# EAGLE schematic pixelD (EAGLE 7.7.0)
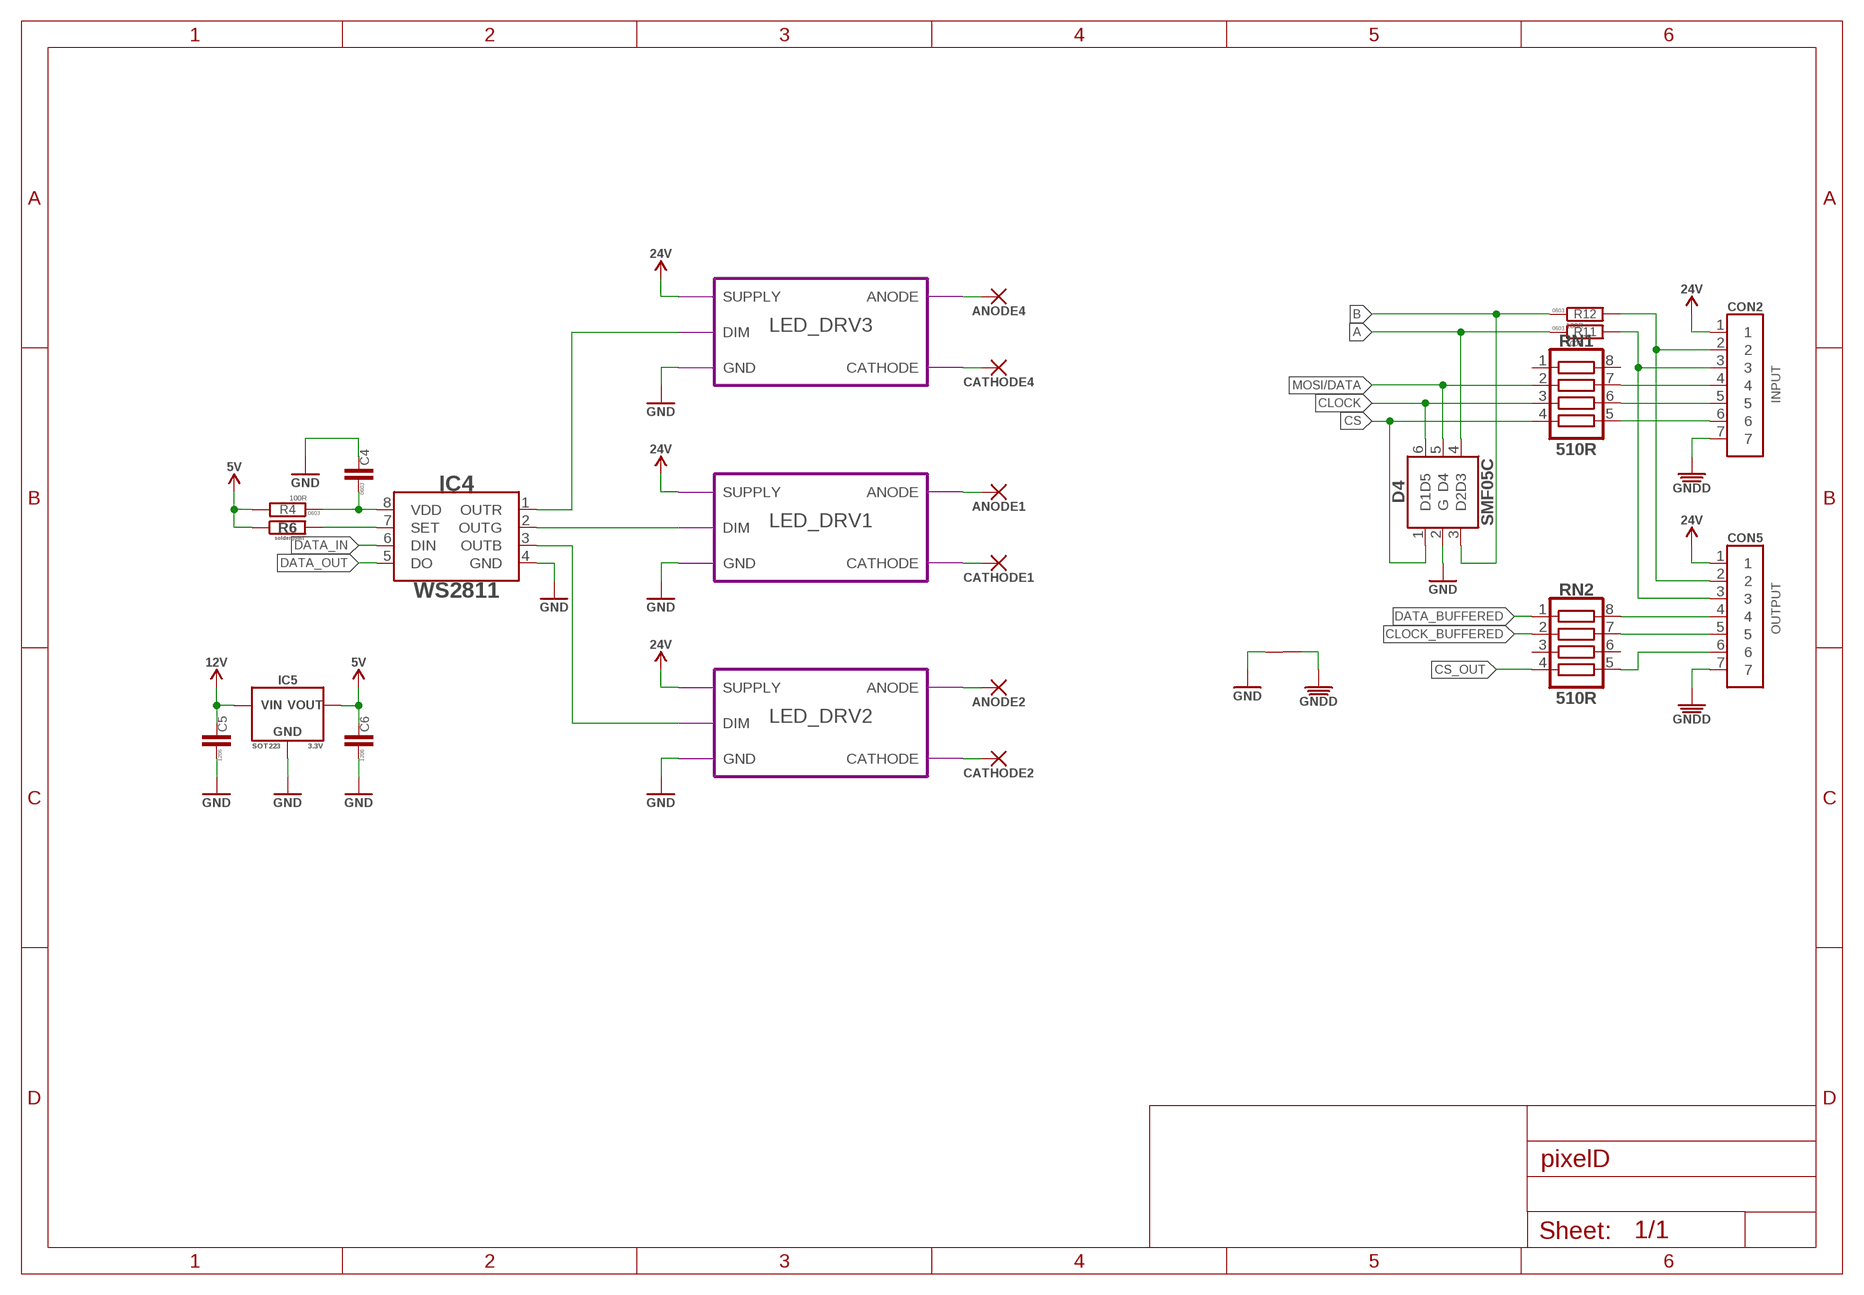
[diagram p0: schematic, sheet 1]

## Parts
ANODE1  WIREPADSMD5-2,5  [5-2,5]
ANODE2  WIREPADSMD5-2,5  [5-2,5]
ANODE4  WIREPADSMD5-2,5  [5-2,5]
C4  C-0603  [C0603]
C5  C-1206  [C1206]
C6  C-1206  [C1206]
CATHODE1  WIREPADSMD5-2,5  [5-2,5]
CATHODE2  WIREPADSMD5-2,5  [5-2,5]
CATHODE4  WIREPADSMD5-2,5  [5-2,5]
CON2  DS1066-07M-SIDE  [DS1066-08M_SIDE]
CON5  DS1066-07M-SIDE  [DS1066-08M_SIDE]
D4  SMF05C  [SC70_6L]
IC4  WS2811  [SOIC8]
IC5  LM1117-3.3-SOT223  [SOT223]
R4  100R  R-0603  [R0603]
R6  SOLDER_JOINT  [RES_0]
R11  100R  R-0603  [R0603]
R12  100R  R-0603  [R0603]
RN1  510R  RESISTOR_ARRAY  [CAT16-J4]
RN2  510R  RESISTOR_ARRAY  [CAT16-J4]
U$6  CONNECTION  [CONNECTION]

## Module instances
LED_DRV3 = PT4115$A
LED_DRV1 = PT4115$A
LED_DRV2 = PT4115$A

## Nets
A: D4.4(D3) R11.1
B: D4.3(D2) R12.1
CLOCK: D4.6(D5) RN1.3
CLOCK_BUFFERED: RN2.2
CS: D4.1(D1) RN1.4
CS_OUT: RN2.4
DATA_BUFFERED: RN2.1
DATA_IN: IC4.6(DIN)
DATA_OUT: IC4.5(DO)
GND: C4.2 C5.P$1 C6.P$1 D4.2(G) IC4.4(GND) IC5.1(GND) U$6.P$2 ; port LED_DRV3.GND LED_DRV1.GND LED_DRV2.GND
GNDD: CON2.7 CON5.7 U$6.P$1
MOSI/DATA: D4.5(D4) RN1.2
N$1: IC4.7(SET) R6.2
N$2: CATHODE1.1(P) ; port LED_DRV1.CATHODE
N$3: C4.1 IC4.8(VDD) R4.1
N$4: ANODE1.1(P) ; port LED_DRV1.ANODE
N$5: CATHODE2.1(P) ; port LED_DRV2.CATHODE
N$6: CON2.4 RN1.7
N$7: ANODE2.1(P) ; port LED_DRV2.ANODE
N$12: CON2.5 RN1.6
N$13: CON5.4 RN2.8
N$14: CON5.6 RN2.5
N$15: CON5.5 RN2.7
N$16: CON2.6 RN1.5
N$17: CATHODE4.1(P) ; port LED_DRV3.CATHODE
N$18: ANODE4.1(P) ; port LED_DRV3.ANODE
PWM1: IC4.1(OUTR) ; port LED_DRV3.DIM
PWM2: IC4.2(OUTG) ; port LED_DRV1.DIM
PWM_B: IC4.3(OUTB) ; port LED_DRV2.DIM
RS485_A1: CON2.2 CON5.2 R12.2
RS485_B1: CON2.3 CON5.3 R11.2
VDD_5V: C6.P$2 IC5.2(VOUT) IC5.4(VOUT) R4.2 R6.1 ; supply symbol labelled 5V
VDD_12V: C5.P$2 IC5.3(VIN) ; supply symbol labelled 12V
VDD_24V: CON2.1 CON5.1 ; port LED_DRV3.SUPPLY LED_DRV1.SUPPLY LED_DRV2.SUPPLY ; supply symbol labelled 24V
Unconnected: RN1.1 RN1.8 RN2.3 RN2.6

## Notes on the sheet
- INPUT
- OUTPUT

## Library data of the parts
ANODE1 ANODE2 ANODE4 CATHODE1 CATHODE2 CATHODE4 = valenok_master_library:WIREPAD: Wire PAD connect wire on PCB
C4 = rc:C; PACKAGE: 0603
C5 C6 = rc:C; PACKAGE: 1206
CON2 CON5 = pixel_masterlib:DS1066-07M: https://lib.chipdip.ru/502/DOC001502873.pdf
D4 = pixel_masterlib:SMF05C; DIGIKEY#: SMF05CCT-ND; MANF: Semtech Corporation; MANF#: SMF05C.TCT
IC4 = WS2811:WS2811: NEOPIXEL Led driver chip.; MANF: WORLDSEMI; MANF#: WS2811
IC5 = watchdog_master_library:LM1117-3.3: IC REG LDO 3.3V 0.8A SOT223; DIGIKEY#: LM1117MPX-3.3/NOPBDKR-ND; MANF: Texas Instruments; MANF#: LM1117MPX-3.3/NOPB; PACKAGE: SOT223; VOLTAGE: 3.3V
R4 R11 R12 = rc:R; PACKAGE: 0603
R6 = pixel_masterlib:SOLDER_JOINT
RN1 RN2 = pixel_masterlib:RESISTOR_ARRAY: Chip Resistor Array 4 Single Resistor; DIGIKEY#: CAT16-511J4LF-ND; MANF: Bourns Inc; MANF#: CAT16-511J4LF
U$6 = usb2can_master_lib:CONNECTION; BOM: EXCLUDE

## Module PT4115
Ports: SUPPLY(pwr) GND(pwr) PWM(in) LED+(out) LED-(out)
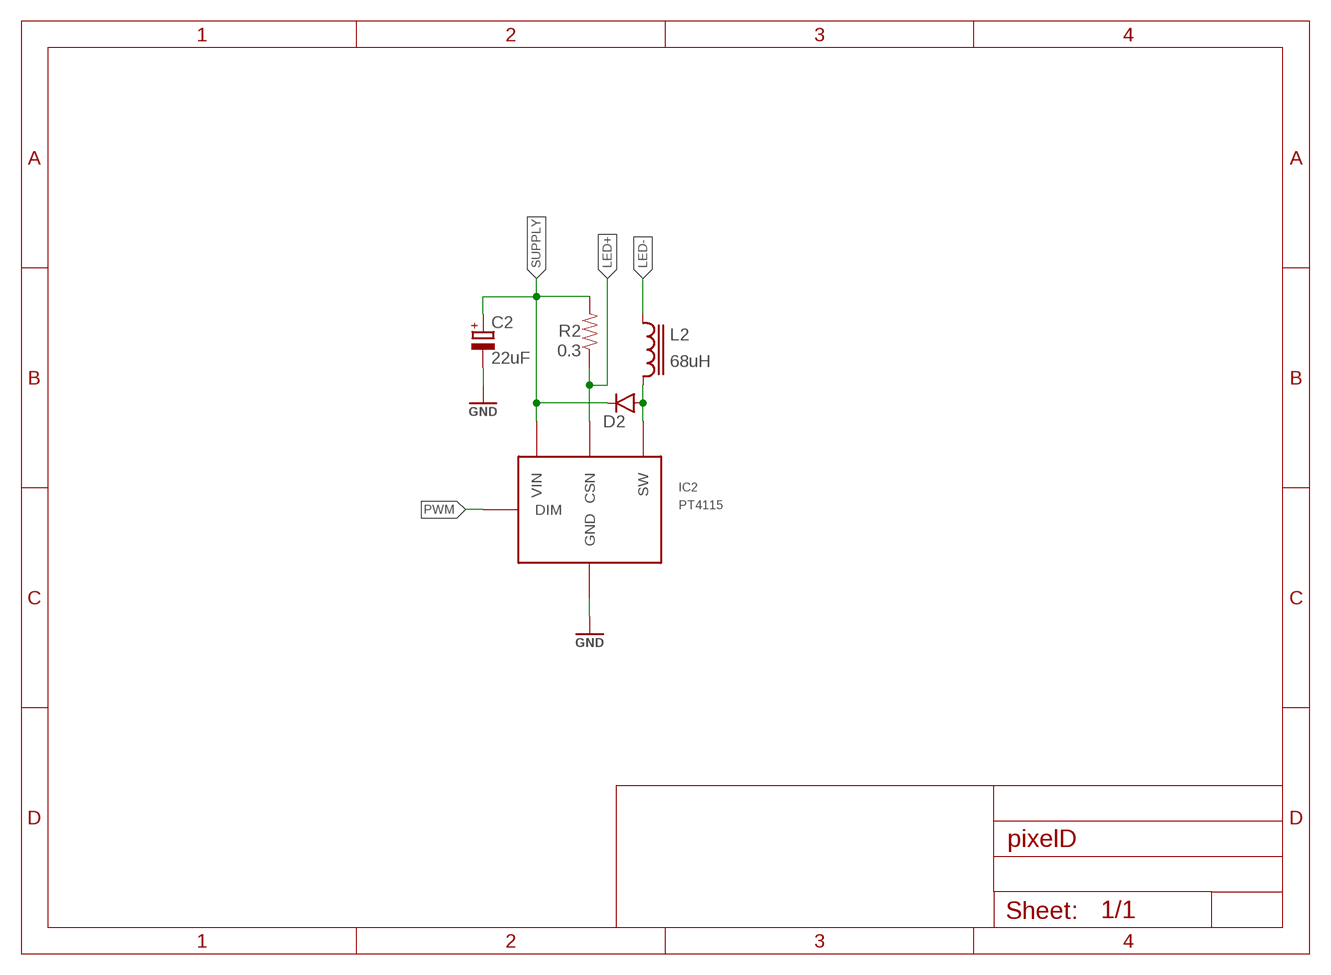
[diagram p1: schematic, module PT4115, sheet 1]

### Parts
C2  22uF  CPOL-EUD/7343-31R  [D/7343-31R]
D2  DIODESMA-KIT  [SMA-DIODE-KIT]
IC2  PT4115  [PT4115]
L2  68uH  ELL6  [ELL6]
R2  0.3  0.3OHM-1/8W-1%(0805)  [0805]

### Nets
GND: C2.- IC2.2(GND) IC2.2A(GND)
LED+: IC2.4(CSN) R2.1
LED-: L2.1
N$1: D2.A IC2.1(SW) L2.2
PWM: IC2.3(DIM)
SUPPLY: C2.+ D2.C IC2.5(VIN) R2.2

### Library data of the parts
C2 = rcl:CPOL-EU: POLARIZED CAPACITOR, European symbol
D2 = SparkFun-DiscreteSemi:DIODE: Diode These are standard reverse protection diodes and small signal diodes. SMA package can handle up to about 1A. SOD-323 can handle about 200mA. What the SOD-323 package when ordering, there are some mfgs out there that are 5-pin packages.
IC2 = PT4115:PT4115: 30V, 1.2A Step-down High Brightness LED Driver with 5000:1 Dimming PDF: http://www.google.pl/url?sa=t&rct=j&q=PT4115&source=web&cd=1&ved=0CC4QFjAA&url=http%3A%2F%2Fwww.micro-bridge.com%2Fdata%2FCRpowtech%2FPT4115E.pdf&ei=9NbxUKXPJNSzhAem2oGoAQ&usg=AFQjCNEsPWIIWjIVjxpF5YN6SPR3coTTpw&bvm=bv.1357700187,d.d2k
L2 = inductor-panasonic:ELL6: Series H Inductor ELL6RH, ELL6SH, ELL6UH
R2 = SparkFun-Resistors:0.3OHM-1/8W-1%(0805): RES-11622; PROD_ID: RES-11622

## Module PT4115$A
Ports: SUPPLY(pwr) GND(pwr) DIM(in) ANODE(pwr) CATHODE(pwr)
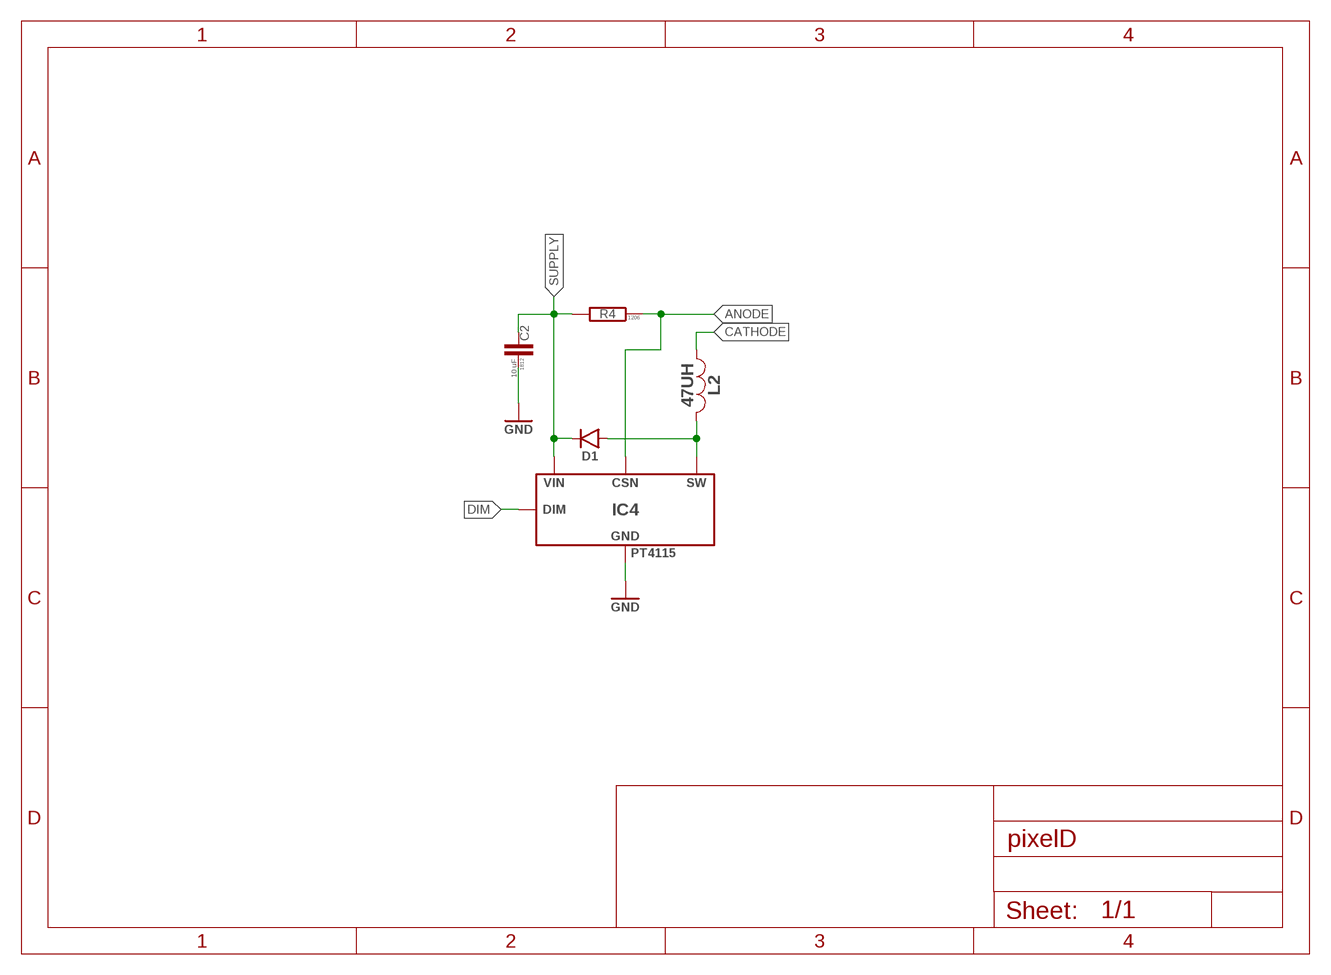
[diagram p2: schematic, module PT4115$A, sheet 1]

### Parts
C2  10 uF  C-1812  [C1812]
D1  CRS08-SOD123  [SOD123]
IC4  PT4115  [PT4115]
L2  47UH  INDUCTOR-470KL-SDR0805  [SDR0805]
R4  R-R1206  [R1206]

### Nets
ANODE: IC4.4(CSN) R4.P$1
CATHODE: L2.2
DIM: IC4.3(DIM)
GND: C2.P$1 IC4.2(GND) IC4.2A(GND)
N$2: D1.A IC4.1(SW) L2.1
SUPPLY: C2.P$2 D1.C IC4.5(VIN) R4.P$2

### Library data of the parts
C2 = rc:C; PACKAGE: 1812
D1 = FMU_masterlib:CRS08; DIGIKEY#: CRS08QMCT-ND; MANF: Toshiba Semiconductor and Storage; MANF#: CRS08(TE85L,Q,M)
IC4 = pixel_masterlib:PT4115: 30V, 1.2A Step-down High Brightness LED Driver with 5000:1 Dimming PDF: http://www.google.pl/url?sa=t&rct=j&q=PT4115&source=web&cd=1&ved=0CC4QFjAA&url=http%3A%2F%2Fwww.micro-bridge.com%2Fdata%2FCRpowtech%2FPT4115E.pdf&ei=9NbxUKXPJNSzhAem2oGoAQ&usg=AFQjCNEsPWIIWjIVjxpF5YN6SPR3coTTpw&bvm=bv.1357700187,d.d2k
L2 = power_inductors:INDUCTOR; DIGIKEY#: SDR0805-470KLCT-ND; MANF: Bourns Inc; MANF#: SDR0805-470KL
R4 = rc:R; PACKAGE: 1206